# Altium schematic sheet CPU_ETH.SchDoc: Thermostat
size 420 x 297 mm; Author: G.Kasprowicz; CompanyName: WUT ISE; DrawnBy: G.Kasprowicz; Organization: WUT ISE; Address1: PW ISE; Address2: Nowowiejska 15/19 00-665 Warsaw; Address3: gkasprow@gmail.com; DocumentNumber: 2; Revision: 1.0; SheetNumber: 2; SheetTotal: 2; ModifiedBy: -; CheckedDate: -; Title2: CPU v1.0; DivGrp: WUT ISE; Designer: G.Kasprowicz; ModifiedDate: -; ProjectName: Sensor Box
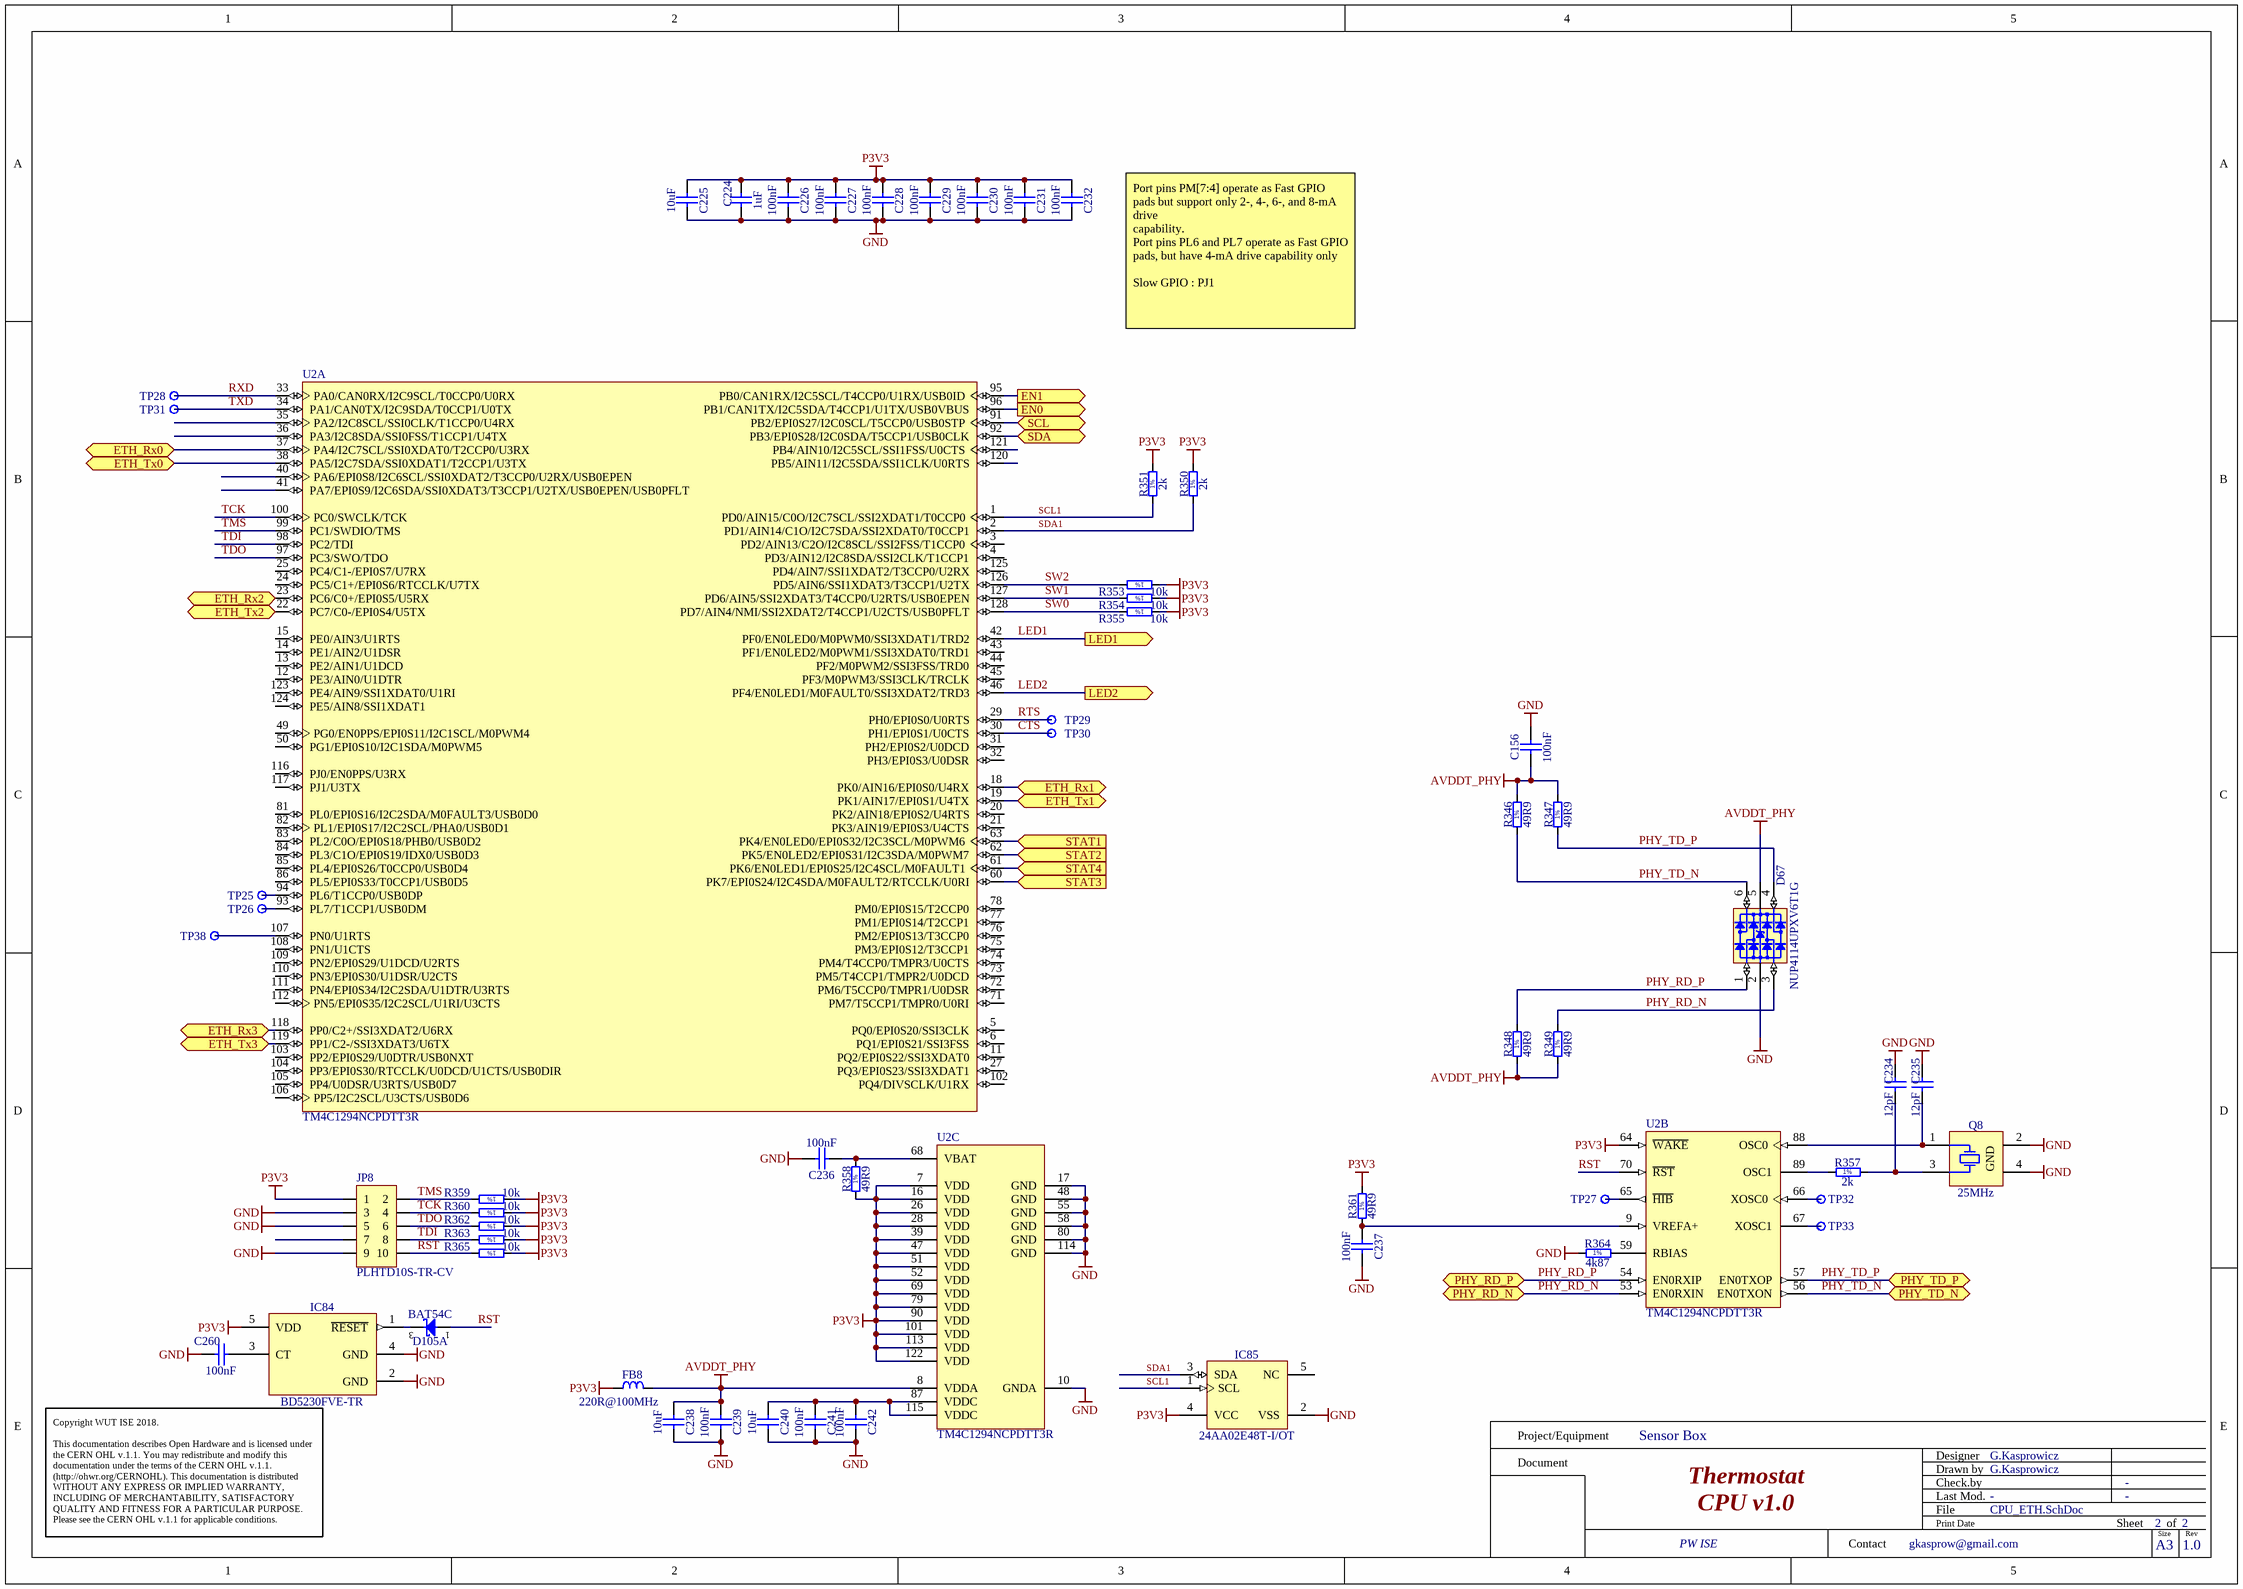
[diagram p0: CPU_ETH.SchDoc]

## Parts
(Parts that share a designator on the sheet are numbered #1, #2 ... from top to bottom, then left to right.)
C156  100nF  [CAPC1005X55N]
C224  1uF  [CAPC1608X87N]
C225  10uF  [CAPC2012X135N]
C226  100nF  [CAPC1005X55N]
C227  100nF  [CAPC1005X55N]
C228  100nF  [CAPC1005X55N]
C229  100nF  [CAPC1005X55N]
C230  100nF  [CAPC1005X55N]
C231  100nF  [CAPC1005X55N]
C232  100nF  [CAPC1005X55N]
C234  12pF  [CAPC1005X55N]
C235  12pF  [CAPC1005X55N]
C236  100nF  [CAPC1005X55N]
C237  100nF  [CAPC1005X55N]
C238  10uF  [CAPC2012X135N]
C239  100nF  [CAPC1005X55N]
C240  10uF  [CAPC2012X135N]
C241  100nF  [CAPC1005X55N]
C242  100nF  [CAPC1005X55N]
C260  100nF  [CAPC1005X55N]
D67  NUP4114UPXV6T1G  [SOTFL50P160X60-6N]
D105  BAT54C  [SOT95P240X130-3N]  (part A of 2)
FB8  220R@100MHz  [INDC2012X105N]
IC84  BD5230FVE-TR  [SOT95P280X145-5N]
IC85  24AA02E48T-I/OT  [SOT95P280X145-5N]
JP8  PLHTD10S-TR-CV  [PLHTD10S-TR-CV]
Q8  25MHz  [XTAL_NDK_NX3225GA]
R346  49R9  [RESC1005X40N]
R347  49R9  [RESC1005X40N]
R348  49R9  [RESC1005X40N]
R349  49R9  [RESC1005X40N]
R350  2k  [RESC1005X40N]
R351  2k  [RESC1005X40N]
R353  10k  [RESC1005X40N]
R354  10k  [RESC1005X40N]
R355  10k  [RESC1005X40N]
R357  2k  [RESC1005X40N]
R358  49R9  [RESC1005X40N]
R359  10k  [RESC1005X40N]
R360  10k  [RESC1005X40N]
R361  49R9  [RESC1005X40N]
R362  10k  [RESC1005X40N]
R363  10k  [RESC1005X40N]
R364  4k87  [RESC1005X40N]
R365  10k  [RESC1005X40N]
TP25  Test Point  [TPS127]  (value not drawn)
TP26  Test Point  [TPS127]  (value not drawn)
TP27  Test Point  [TPS127]  (value not drawn)
TP28  Test Point  [TPS127]  (value not drawn)
TP29  Test Point  [TPS127]  (value not drawn)
TP30  Test Point  [TPS127]  (value not drawn)
TP31  Test Point  [TPS127]  (value not drawn)
TP32  Test Point  [TPS127]  (value not drawn)
TP33  Test Point  [TPS127]  (value not drawn)
TP38  Test Point  [TPS127]  (value not drawn)
U2#1  TM4C1294NCPDTT3R  [PDT0128A_N]  (part A of 3)
U2#2  TM4C1294NCPDTT3R  [PDT0128A_N]  (parts B,C of 3)

## Ports
EN0 (out), EN1 (out), ETH_Rx0 (bidir), ETH_Rx1 (bidir), ETH_Rx2 (bidir), ETH_Rx3 (bidir), ETH_Tx0 (bidir), ETH_Tx1 (bidir), ETH_Tx2 (bidir), ETH_Tx3 (bidir), LED1 (out), LED2 (out), PHY_RD_N (bidir), PHY_RD_P (bidir), PHY_TD_N (bidir), PHY_TD_P (bidir), SCL (bidir), SDA (bidir), STAT1 (in), STAT2 (in), STAT3 (in), STAT4 (in)

## Nets
AVDDT_PHY: C156.1 C238.1 C239.2 D67.5(VBUS) FB8.2 R346.2 R347.2 R348.1 R349.1 U2#2.8(VDDA)
GND: C156.2 C224.1 C225.2 C226.1 C227.1 C228.1 C229.1 C230.1 C231.1 C232.1 C234.2 C235.2 C236.1 C237.1 C238.2 C239.1 C240.2 C241.1 C242.1 C260.2 D67.2(GND) IC84.2(GND) IC84.4(GND) IC85.2(VSS) JP8.3 JP8.5 JP8.9 Q8.2(GND) Q8.4(GND) R364.1 U2#2.10(GNDA) U2#2.17(GND) U2#2.48(GND) U2#2.55(GND) U2#2.58(GND) U2#2.80(GND) U2#2.114(GND)
P3V3: C224.2 C225.1 C226.2 C227.2 C228.2 C229.2 C230.2 C231.2 C232.2 FB8.1 IC84.5(VDD) IC85.4(VCC) JP8.1 R350.2 R351.2 R353.1 R354.1 R355.1 R358.1 R359.1 R360.1 R361.2 R362.1 R363.1 R365.1 U2#2.7(VDD) U2#2.16(VDD) U2#2.26(VDD) U2#2.28(VDD) U2#2.39(VDD) U2#2.47(VDD) U2#2.51(VDD) U2#2.52(VDD) U2#2.64(~{WAKE}) U2#2.69(VDD) U2#2.79(VDD) U2#2.90(VDD) U2#2.101(VDD) U2#2.113(VDD) U2#2.122(VDD)
CTS: TP30.1 U2#1.30(PH1/EPI0S1/U0CTS)
EN0: U2#1.96(PB1/CAN1TX/I2C5SDA/T4CCP1/U1TX/USB0VBUS) ; port EN0
EN1: U2#1.95(PB0/CAN1RX/I2C5SCL/T4CCP0/U1RX/USB0ID) ; port EN1
ETH_Rx0: U2#1.37(PA4/I2C7SCL/SSI0XDAT0/T2CCP0/U3RX) ; port ETH_Rx0
ETH_Rx1: U2#1.18(PK0/AIN16/EPI0S0/U4RX) ; port ETH_Rx1
ETH_Rx2: U2#1.23(PC6/C0+/EPI0S5/U5RX) ; port ETH_Rx2
ETH_Rx3: U2#1.118(PP0/C2+/SSI3XDAT2/U6RX) ; port ETH_Rx3
ETH_Tx0: U2#1.38(PA5/I2C7SDA/SSI0XDAT1/T2CCP1/U3TX) ; port ETH_Tx0
ETH_Tx1: U2#1.19(PK1/AIN17/EPI0S1/U4TX) ; port ETH_Tx1
ETH_Tx2: U2#1.22(PC7/C0-/EPI0S4/U5TX) ; port ETH_Tx2
ETH_Tx3: U2#1.119(PP1/C2-/SSI3XDAT3/U6TX) ; port ETH_Tx3
LED1: U2#1.42(PF0/EN0LED0/M0PWM0/SSI3XDAT1/TRD2) ; port LED1
LED2: U2#1.46(PF4/EN0LED1/M0FAULT0/SSI3XDAT2/TRD3) ; port LED2
PHY_RD_N: D67.3(I/O2) R349.2 U2#2.53(EN0RXIN) ; port PHY_RD_N
PHY_RD_P: D67.1(I/O1) R348.2 U2#2.54(EN0RXIP) ; port PHY_RD_P
PHY_TD_N: D67.6(I/O4) R346.1 U2#2.56(EN0TXON) ; port PHY_TD_N
PHY_TD_P: D67.4(I/O3) R347.1 U2#2.57(EN0TXOP) ; port PHY_TD_P
RST: D105.1(A) JP8.10 R365.2 U2#2.70(~{RST})
RTS: TP29.1 U2#1.29(PH0/EPI0S0/U0RTS)
RXD: TP28.1 U2#1.33(PA0/CAN0RX/I2C9SCL/T0CCP0/U0RX)
SCL: U2#1.91(PB2/EPI0S27/I2C0SCL/T5CCP0/USB0STP) ; port SCL
SCL1: IC85.1(SCL) R351.1 U2#1.1(PD0/AIN15/C0O/I2C7SCL/SSI2XDAT1/T0CCP0)
SDA: U2#1.92(PB3/EPI0S28/I2C0SDA/T5CCP1/USB0CLK) ; port SDA
SDA1: IC85.3(SDA) R350.1 U2#1.2(PD1/AIN14/C1O/I2C7SDA/SSI2XDAT0/T0CCP1)
STAT1: U2#1.63(PK4/EN0LED0/EPI0S32/I2C3SCL/M0PWM6) ; port STAT1
STAT2: U2#1.62(PK5/EN0LED2/EPI0S31/I2C3SDA/M0PWM7) ; port STAT2
STAT3: U2#1.60(PK7/EPI0S24/I2C4SDA/M0FAULT2/RTCCLK/U0RI) ; port STAT3
STAT4: U2#1.61(PK6/EN0LED1/EPI0S25/I2C4SCL/M0FAULT1) ; port STAT4
SW0: R355.2 U2#1.128(PD7/AIN4/NMI/SSI2XDAT2/T4CCP1/U2CTS/USB0PFLT)
SW1: R354.2 U2#1.127(PD6/AIN5/SSI2XDAT3/T4CCP0/U2RTS/USB0EPEN)
SW2: R353.2 U2#1.126(PD5/AIN6/SSI1XDAT3/T3CCP1/U2TX)
TCK: JP8.4 R360.2 U2#1.100(PC0/SWCLK/TCK)
TDI: JP8.8 R363.2 U2#1.98(PC2/TDI)
TDO: JP8.6 R362.2 U2#1.97(PC3/SWO/TDO)
TMS: JP8.2 R359.2 U2#1.99(PC1/SWDIO/TMS)
TXD: TP31.1 U2#1.34(PA1/CAN0TX/I2C9SDA/T0CCP1/U0TX)
NetC234_1: C234.1 Q8.3(X) R357.2
NetC235_1: C235.1 Q8.1(X) U2#2.88(OSC0)
NetC236_2: C236.2 R358.2 U2#2.68(VBAT)
NetC237_2: C237.2 R361.1 U2#2.9(VREFA+)
NetC240_1: C240.1 C241.2 C242.2 U2#2.87(VDDC) U2#2.115(VDDC)
NetC260_1: C260.1 IC84.3(CT)
NetD105_3: D105.3(COMC) IC84.1(~{RESET})
NetR357_1: R357.1 U2#2.89(OSC1)
NetR364_2: R364.2 U2#2.59(RBIAS)
NetTP25_1: TP25.1 U2#1.94(PL6/T1CCP0/USB0DP)
NetTP26_1: TP26.1 U2#1.93(PL7/T1CCP1/USB0DM)
NetTP27_1: TP27.1 U2#2.65(~{HIB})
NetTP32_1: TP32.1 U2#2.66(XOSC0)
NetTP33_1: TP33.1 U2#2.67(XOSC1)
NetTP38_1: TP38.1 U2#1.107(PN0/U1RTS)

Not connected (* = marked no-connect by the designer): IC85 5(NC); JP8 7; U2#1 3(PD2/AIN13/C2O/I2C8SCL/SSI2FSS/T1CCP0) 4(PD3/AIN12/I2C8SDA/SSI2CLK/T1CCP1) 5(PQ0/EPI0S20/SSI3CLK) 6(PQ1/EPI0S21/SSI3FSS) 11(PQ2/EPI0S22/SSI3XDAT0) 12(PE3/AIN0/U1DTR) 13(PE2/AIN1/U1DCD) 14(PE1/AIN2/U1DSR) 15(PE0/AIN3/U1RTS) 20(PK2/AIN18/EPI0S2/U4RTS) 21(PK3/AIN19/EPI0S3/U4CTS) 24(PC5/C1+/EPI0S6/RTCCLK/U7TX) 25(PC4/C1-/EPI0S7/U7RX) 27(PQ3/EPI0S23/SSI3XDAT1) 31(PH2/EPI0S2/U0DCD) 32(PH3/EPI0S3/U0DSR) 35(PA2/I2C8SCL/SSI0CLK/T1CCP0/U4RX) 36(PA3/I2C8SDA/SSI0FSS/T1CCP1/U4TX) 40(PA6/EPI0S8/I2C6SCL/SSI0XDAT2/T3CCP0/U2RX/USB0EPEN) 41(PA7/EPI0S9/I2C6SDA/SSI0XDAT3/T3CCP1/U2TX/USB0EPEN/USB0PFLT) 43(PF1/EN0LED2/M0PWM1/SSI3XDAT0/TRD1) 44(PF2/M0PWM2/SSI3FSS/TRD0) 45(PF3/M0PWM3/SSI3CLK/TRCLK) 49(PG0/EN0PPS/EPI0S11/I2C1SCL/M0PWM4) 50(PG1/EPI0S10/I2C1SDA/M0PWM5) 71(PM7/T5CCP1/TMPR0/U0RI) 72(PM6/T5CCP0/TMPR1/U0DSR) 73(PM5/T4CCP1/TMPR2/U0DCD) 74(PM4/T4CCP0/TMPR3/U0CTS) 75(PM3/EPI0S12/T3CCP1) 76(PM2/EPI0S13/T3CCP0) 77(PM1/EPI0S14/T2CCP1) 78(PM0/EPI0S15/T2CCP0) 81(PL0/EPI0S16/I2C2SDA/M0FAULT3/USB0D0) 82(PL1/EPI0S17/I2C2SCL/PHA0/USB0D1) 83(PL2/C0O/EPI0S18/PHB0/USB0D2) 84(PL3/C1O/EPI0S19/IDX0/USB0D3) 85(PL4/EPI0S26/T0CCP0/USB0D4) 86(PL5/EPI0S33/T0CCP1/USB0D5) 102(PQ4/DIVSCLK/U1RX) 103(PP2/EPI0S29/U0DTR/USB0NXT) 104(PP3/EPI0S30/RTCCLK/U0DCD/U1CTS/USB0DIR) 105(PP4/U0DSR/U3RTS/USB0D7) 106(PP5/I2C2SCL/U3CTS/USB0D6) 108(PN1/U1CTS) 109(PN2/EPI0S29/U1DCD/U2RTS) 110(PN3/EPI0S30/U1DSR/U2CTS) 111(PN4/EPI0S34/I2C2SDA/U1DTR/U3RTS) 112(PN5/EPI0S35/I2C2SCL/U1RI/U3CTS) 116(PJ0/EN0PPS/U3RX) 117(PJ1/U3TX) 120(PB5/AIN11/I2C5SDA/SSI1CLK/U0RTS) 121(PB4/AIN10/I2C5SCL/SSI1FSS/U0CTS) 123(PE4/AIN9/SSI1XDAT0/U1RI) 124(PE5/AIN8/SSI1XDAT1) 125(PD4/AIN7/SSI1XDAT2/T3CCP0/U2RX)

## Notes on the sheet
- Port pins PM[7:4] operate as Fast GPIO pads but support only 2-, 4-, 6-, and 8-mA drive
  capability.
  Port pins PL6 and PL7 operate as Fast GPIO pads, but have 4-mA drive capability only
  Slow GPIO : PJ1
- Project/Equipment
- Document
- Designer
- Drawn by
- Check.by
- Copyright WUT ISE 2018.
  This documentation describes Open Hardware and is licensed under the CERN OHL v.1.1. You may redistribute and modify this documentation under the terms of the CERN OHL v.1.1. (http://ohwr.org/CERNOHL). This documentation is distributed WITHOUT ANY EXPRESS OR IMPLIED WARRANTY, INCLUDING OF MERCHANTABILITY, SATISFACTORY QUALITY AND FITNESS FOR A PARTICULAR PURPOSE. Please see the CERN OHL v.1.1 for applicable conditions.
- Contact
- File
- Last Mod.
- Print Date
- Sheet
- Size
- A3
- of
- Rev
- (in symbol R0402_2K_1%_0.0625W_100PPM) 1%
- (in symbol R0402_4K87_1%_0.0625W_100PPM) 1%
- (in symbol R0402_10K_1%_0.0625W_100PPM) 1%
- (in symbol R0402_49R9_1%_0.0625W_100PPM) 1%

## Library data of the parts
C156 C226-C232 C236 C237 C239 C241 C242 C260 = CC0402_100NF_16V_10%_X5R: Non-polarised capacitor; Part Description: SMD Multilayer Chip Ceramic Capacitor; Manufacturer: GENERIC; Manufacturer1 Part Number: GRM155R61C104KA88D; Voltage: 16V; TC: X5R; Tolerance: ±10%; Part Number: CC0402_100NF_16V_10%_X5R; Component Kind: Standard; Component Type: Standard; Pin Count: 2; Value: 100nF; Status: None; Manufacturer Part Number: CC0402_100NF_16V_10%_X5R; Case: 0402; Mounted: Yes; Socket: No; SMD: Yes; Manufacturer1 Example: MURATA; Manufacturer1 ComponentHeight: 0.55mm; HelpURL: \\cern.ch\dfs\Applications\Altium\Datasheets\CC0402_X5R_MURATA_GRM.pdf; Author: CERN DEM JLC; CreateDate: 10.12.2013; LatestRevisionDate: 10.12.2013; Sense: No
C224 = CC0603_1UF_25V_10%_X7R: Non-polarised capacitor; Part Description: SMD Multilayer Chip Ceramic Capacitor; Manufacturer: GENERIC; Manufacturer1 Part Number: GRM188R71E105KA12D; Voltage: 25V; TC: X7R; Tolerance: ±10%; Table: Capacitors SMD; Part Number: CC0603_1UF_25V_10%_X7R; Component Kind: Standard; Component Type: Standard; Pin Count: 2; Value: 1uF; Status: None; Manufacturer Part Number: CC0603_1UF_25V_10%_X7R; Case: 0603; Mounted: Yes; Socket: No; SMD: Yes; Manufacturer1 Example: MURATA; Manufacturer1 ComponentHeight: 0.9mm; HelpURL: \\cern.ch\dfs\Applications\Altium\Datasheets\CC0603_X7R_MURATA.pdf; Author: CERN DEM JLC; CreateDate: 2011-01-18; LatestRevisionDate: 2011-01-18
C225 C238 C240 = CC0805_10UF_16V_10%_X5R: Non-polarised capacitor; Part Description: SMD Multilayer Chip Ceramic Capacitor; Manufacturer: GENERIC; Manufacturer1 Part Number: C0805C106K4PAC; Voltage: 16V; TC: X5R; Tolerance: ±10%; Part Number: CC0805_10UF_16V_10%_X5R; Component Kind: Standard; Component Type: Standard; Pin Count: 2; Value: 10uF; Status: Preferred; Manufacturer Part Number: CC0805_10UF_16V_10%_X5R; Case: 0805; Mounted: Yes; Socket: No; SMD: Yes; Manufacturer1 Example: KEMET; Manufacturer1 ComponentHeight: 1.4mm; HelpURL: \\cern.ch\dfs\Applications\Altium\Datasheets\CC1206_X5R_KEMET.pdf; Author: CERN DEM JLC; CreateDate: 03.12.2007; LatestRevisionDate: 03.12.2007; Sense: No
C234 C235 = CC0402_12PF_50V_5%_C0G: Non-polarised capacitor; Part Description: SMD Multilayer Chip Ceramic Capacitor; Manufacturer: GENERIC; Manufacturer1 Part Number: C0402C120J5GACTU; Voltage: 50V; TC: C0G/NP0; Tolerance: ±5%; Part Number: CC0402_12PF_50V_5%_C0G; Component Kind: Standard; Component Type: Standard; Pin Count: 2; Value: 12pF; Status: Preferred; Manufacturer Part Number: CC0402_12PF_50V_5%_C0G; Case: 0402; Mounted: Yes; Socket: No; SMD: Yes; Sense: No; Manufacturer1 Example: KEMET; Manufacturer1 ComponentHeight: 0.55mm; HelpURL: \\cern.ch\dfs\Applications\Altium\Datasheets\CC0805_C0G_KEMET_(Commercial Grade).pdf; Author: CERN DEM JLC; CreateDate: 04.10.2016; LatestRevisionDate: 04.10.2016
D67 = NUP4114UPXV6T1G: Part Description: ESD Protection Diodes Array (8kV) with Low Clamping Voltage; Manufacturer: ON SEMICONDUCTOR; Voltage: 5.5V; PressFit: No; Bonding: No; Part Number: NUP4114UPXV6T1G; Component Kind: Standard; Component Type: Standard; Device: NUP4114UPXV6T1G; PackageDescription: SOTFL (SOT666, SOT563,), 0.50mm, Pitch; 6 Pin, 1.20mm W X 1.60mm L X 0.60mm H Body, IPC Medium Density; Manufacturer Part Number: NUP4114UPXV6T1G; Pin Count: 8; Mounted: Yes; Socket: No; SMD: Yes; Sense: No; ComponentHeight: 1.75mm; HelpURL: \\cern.ch\dfs\Applications\Altium\Datasheets\NUP4114UPXV6T1G.pdf; Author: CERN DEM JLC; CreateDate: 05.12.2012; LatestRevisionDate: 05.12.2012
D105 = BAT54C: Dual Common Cathode Schottky Diodes; Part Description: Dual Common Cathode Small Signal Schottky Diode; Manufacturer: FAIRCHILD SEMICONDUCTOR; Voltage: 30V; Power: 200mA; PressFit: No; Bonding: No; Part Number: BAT54C; Component Kind: Standard; Component Type: Standard; Device: BAT54C; PackageDescription: SOT23 3-Leads, Pitch 0.95mm - Body 1.3x2.9mm, IPC Medium Density; Manufacturer Part Number: BAT54C; Pin Count: 3; Case: SOT23-3; Mounted: Yes; Socket: No; SMD: Yes; ComponentHeight: 1.30mm; HelpURL: \\cern.ch\dfs\Applications\Altium\Datasheets\BAT54C.pdf; Author: CERN DEM JLC; CreateDate: 17.09.2009; LatestRevisionDate: 27.05.2010; Sense: No
FB8 = IND0805_MURATA_BLM21PG221SN1D: Inductor; Part Description: SMD EMIFIL Suppression Chip Ferrite Bead; Manufacturer: MURATA; Power: 2A; Resistance: 0.05R; Tolerance: ±25%; Table: Inductors SMD; Part Number: IND0805_MURATA_BLM21PG221SN1D; Component Kind: Standard; Component Type: Standard; Pin Count: 2; Value: 220R@100MHz; Status: None; Manufacturer Part Number: BLM21PG221SN1D; Case: 0805; Mounted: Yes; Socket: No; SMD: Yes; ComponentHeight: 1.05mm; HelpURL: \\cern.ch\dfs\Applications\Altium\Datasheets\IND0402_MURATA_BLM21P.pdf; Author: CERN DEM JLC; CreateDate: 2010-01-25; LatestRevisionDate: 2010-01-25
IC84 = VMON_BD5230FVE-TR: Free Delay Time Setting  CMOS Voltage Detector; Part Description: 5V, Low Quiescent Current, Programmable-Delay Supervisory Circuit; Manufacturer: Rohm; PressFit: No; Bonding: No; Part Number: BD5230FVE-TR; Component Kind: Standard; Component Type: Standard; Device: BD5230FVE-TR; PackageDescription: SOT23, 5-Leads, Body 1.6x3.0mm, Pitch 0.95mm, IPC Medium Density; Manufacturer Part Number: BD5230FVE-TR; Pin Count: 5; Case: SOT23-5; Mounted: Yes; Socket: No; SMD: Yes; Sense: No; ComponentHeight: 1.45mm; Author: GK; HelpURL: \\cern.ch\dfs\Applications\Altium\Datasheets\TPS3808G50DBVT.pdf; CreateDate: 02.03.2015; LatestRevisionDate: 02.03.2015
IC85 = 24AA02E48T-I/OT: 1.7V-5.5V, 2K I2C Serial EEPROM With EUI-48 Node Identity; Manufacturer: MICROCHIP TECHNOLOGY; PressFit: No; Bonding: No; Part Number: 24AA02E48T-I/OT; Component Kind: Standard; Component Type: Standard; Device: 24AA02E48T-I/OT; PackageDescription: SOT, 0.95mm pitch; 5 pin, 1.60mm W X 2.90mm L X 1.45mm H body, IPC Medium Density; Part Description: 1.7V-5.5V, 2K I2C Serial EEPROM With EUI-48 Node Identity; Manufacturer Part Number: 24AA02E48T-I/OT; Pin Count: 5; Case: SOT23-5; Mounted: Yes; Socket: No; SMD: Yes; Sense: No; ComponentHeight: 1.45mm; HelpURL: \\cern.ch\dfs\Applications\Altium\Datasheets\24AA02E48T-I-OT.pdf; Author: CERN DEM MR; CreateDate: 31.03.2016; LatestRevisionDate: 31.03.2016
JP8 = CON_2x5 1.27 SMT Male: 1.27 mm dual row goldpin (Maritex)
Q8 = XTAL_25MHZ_NDK_NX3225GA: Crystal 4 pins 1=XTAL Control 2=GND3=XTAL 4=GND; Part Description: Tolerance: ± 20ppm, Stability: ± 30ppm, -40°C to +85°C, 8pF, 50 Ohms ESR, Automotive Quartz Crystal, NX3225GA Series; Manufacturer: NDK; Manufacturer Part Number: NX3225GA-25.000M-STD-CRG; PressFit: No; Bonding: No; Part Number: XTAL_25MHZ_NDK_NX3225GA; Component Kind: Standard; Component Type: Standard; PackageDescription: 4 Pins, SMD Crystal, Body 2.5x3.2mm, NX3225GA Series; Value: 25MHz; Pin Count: 4; Mounted: Yes; Socket: No; SMD: Yes; Sense: No; ComponentHeight: 0.9mm; HelpURL: \\cern.ch\dfs\Applications\Altium\Datasheets\XTAL_NDK_NX3225GA.pdf; Author: CERN DEM MR; CreateDate: 15.02.2018; LatestRevisionDate: 15.02.2018
R346-R349 R358 R361 = R0402_49R9_1%_0.0625W_100PPM: Resistor - 1%; Part Description: General Purpose Thick Film Chip Resistor; Manufacturer: GENERIC; Manufacturer1 Part Number: 232270674999L or RC0402FR-0749R9L; TC: ±100ppm/°C; Table: Resistors SMD; Part Number: R0402_49R9_1%_0.0625W_100PPM; Component Kind: Standard; Component Type: Standard; Pin Count: 2; Value: 49R9; Status: Not recommended; Power: 0.0625W; Tolerance: ±1%; Manufacturer Part Number: R0402_49R9_1%_0.0625W_100PPM; Case: 0402; Mounted: Yes; Socket: No; SMD: Yes; Manufacturer1 Example: YAGEO PHYCOMP; Manufacturer1 ComponentHeight: 0.4mm; HelpURL: \\cern.ch\dfs\Applications\Altium\Datasheets\R0402_Phycomp_RC0402.pdf; Author: CERN DEM JLC; CreateDate: 2012-10-24; LatestRevisionDate: 2012-10-24
R350 R351 R357 = R0402_2K_1%_0.0625W_100PPM: Resistor - 1%; Part Description: General Purpose Thick Film Chip Resistor; Manufacturer: GENERIC; Manufacturer1 Part Number: 232270672002L; TC: ±100ppm/°C; PressFit: No; Part Number: R0402_2K_1%_0.0625W_100PPM; Component Kind: Standard; Component Type: Standard; Pin Count: 2; Value: 2k; Status: Not Recommended; Power: 0.0625W; Tolerance: ±1%; Manufacturer Part Number: R0402_2K_1%_0.0625W_100PPM; Case: 0402; Mounted: Yes; Socket: No; SMD: Yes; Manufacturer1 Example: YAGEO PHYCOMP; Manufacturer1 ComponentHeight: 0.4mm; HelpURL: \\cern.ch\dfs\Applications\Altium\Datasheets\R0402_Phycomp_RC0402.pdf; Author: CERN DEM JLC; CreateDate: 03.12.2007; LatestRevisionDate: 17.10.2012; Sense: No
R353-R355 R359 R360 R362 R363 R365 = R0402_10K_1%_0.0625W_100PPM: Resistor - 1%; Part Description: General Purpose Thick Film Chip Resistor; Manufacturer: GENERIC; Manufacturer1 Part Number: 232270671003L; TC: ±100ppm/°C; Table: Resistors SMD; Part Number: R0402_10K_1%_0.0625W_100PPM; Component Kind: Standard; Component Type: Standard; Pin Count: 2; Value: 10k; Status: Not recommended; Power: 0.0625W; Tolerance: ±1%; Manufacturer Part Number: R0402_10K_1%_0.0625W_100PPM; Case: 0402; Mounted: Yes; Socket: No; SMD: Yes; Manufacturer1 Example: YAGEO PHYCOMP; Manufacturer1 ComponentHeight: 0.4mm; HelpURL: \\cern.ch\dfs\Applications\Altium\Datasheets\R0402_Phycomp_RC0402.pdf; Author: CERN DEM JLC; CreateDate: 2007-12-03; LatestRevisionDate: 2012-10-17
R364 = R0402_4K87_1%_0.0625W_100PPM: Resistor - 1%; Part Description: General Purpose Thick Film Chip Resistor; Manufacturer: GENERIC; Manufacturer1 Part Number: CRCW04024K87FKED; TC: ±100ppm/°C; PressFit: No; Part Number: R0402_4K87_1%_0.0625W_100PPM; Component Kind: Standard; Component Type: Standard; Pin Count: 2; Value: 4k87; Status: None; Power: 0.0625W; Tolerance: ±1%; Manufacturer Part Number: R0402_4K87_1%_0.0625W_100PPM; Case: 0402; Mounted: Yes; Sense: No; Socket: No; SMD: Yes; Manufacturer1 Example: VISHAY; Manufacturer1 ComponentHeight: 0.4mm; HelpURL: \\cern.ch\dfs\Applications\Altium\Datasheets\R0402_VISHAY_CRCW e3.pdf; Author: CERN DEM JLC; CreateDate: 04.11.2014; LatestRevisionDate: 04.11.2014
TP25-TP33 TP38 = SMD_PAD_1.27X1.27MM: Part Description: 1.27mm x 1.27mm PCB Copper Area (SMD Test Point); Mounted: No; Part Number: SMD_PAD_1.27X1.27MM; Component Kind: Standard (No BOM); Component Type: Standard (No BOM); Pin Count: 1; Family: Test Point; Socket: No; SMD: Yes; Sense: No; Status: None; ComponentHeight: 0mm; HelpURL: Undefined; Author: CERN DEM JLC; CreateDate: 12.01.2008; LatestRevisionDate: 12.01.2008; PackageDescription: 1.27mm x 1.27mm PCB Copper Area (SMD Test Point)
U2#1 U2#2 = CMP-0945-00009-2: Tiva C Series Microcontroller, 1024 KB Flash, 256 KB SRAM, 12 Bit, 20 Channels, -40 to 105 degC, 128-Pin TQFP (PDT), Green (RoHS & no Sb/Br), Tape and Reel; Manufacturer: Texas Instruments; ADC Resolution: 12 Bits; Max Speed: 120 MHz; ADC Channels: 20; CPU: ARM Cortex-M4; Flash: 1024 KB; SRAM: 256 KB; ComponentLink3URL: http://www.ti.com/lit/ml/mpqf013/mpqf013.pdf; ComponentLink3Description: Package Specification; ComponentLink2URL: http://www.ti.com/lit/ds/symlink/tm4c1294ncpdt.pdf; Packing: Tape and Reel; ComponentLink1URL: http://www.ti.com/; Temperature Range: -40 to 105 degC; PackageReference: PDT0128A; PackageVersion: 4087726/A; ComponentLink2Description: Datasheet; PartNumber: TM4C1294NCPDTT3R; ComponentLink1Description: Manufacturer URL; PackageDescription: 128-Pin Thin Quad Flat Package, Body 14 x 14 mm, Pitch 0.4 mm; DatasheetVersion: 15863.2743; Eco-Plan: Green (RoHS & no Sb/Br); Mounting Technology: Surface Mount